# Altium schematic sheet DC_DC.SchDoc
size A4; SheetNumber: 3; SheetTotal: 7
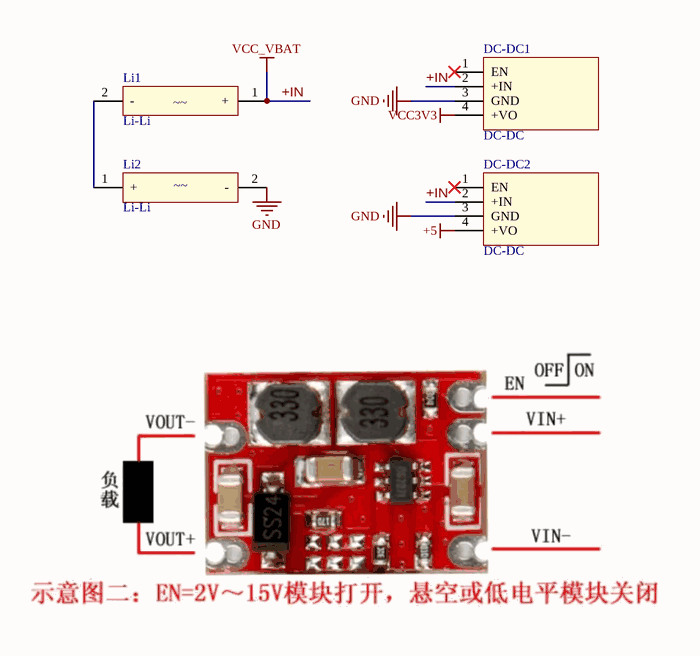
[diagram p0: DC_DC.SchDoc]

## Parts
DC-DC1  DC-DC  [DC-DC]
DC-DC2  DC-DC  [DC-DC]
Li1  Li-Li  [单个5号电池盒]
Li2  Li-Li  [单个5号电池盒]

## Nets
+5: DC-DC2.4(+VO)
+IN: DC-DC1.2(+IN) DC-DC2.2(+IN) Li1.1(+)  [also labelled VCC_VBAT]
GND: DC-DC1.3(GND) DC-DC2.3(GND) Li2.2(-)
VCC3V3: DC-DC1.4(+VO)
NetLi1_2: Li1.2(-) Li2.1(+)

Not connected (* = marked no-connect by the designer): DC-DC1 1(EN)*; DC-DC2 1(EN)*

## Notes on the sheet
- (in symbol Li-Li) ~~